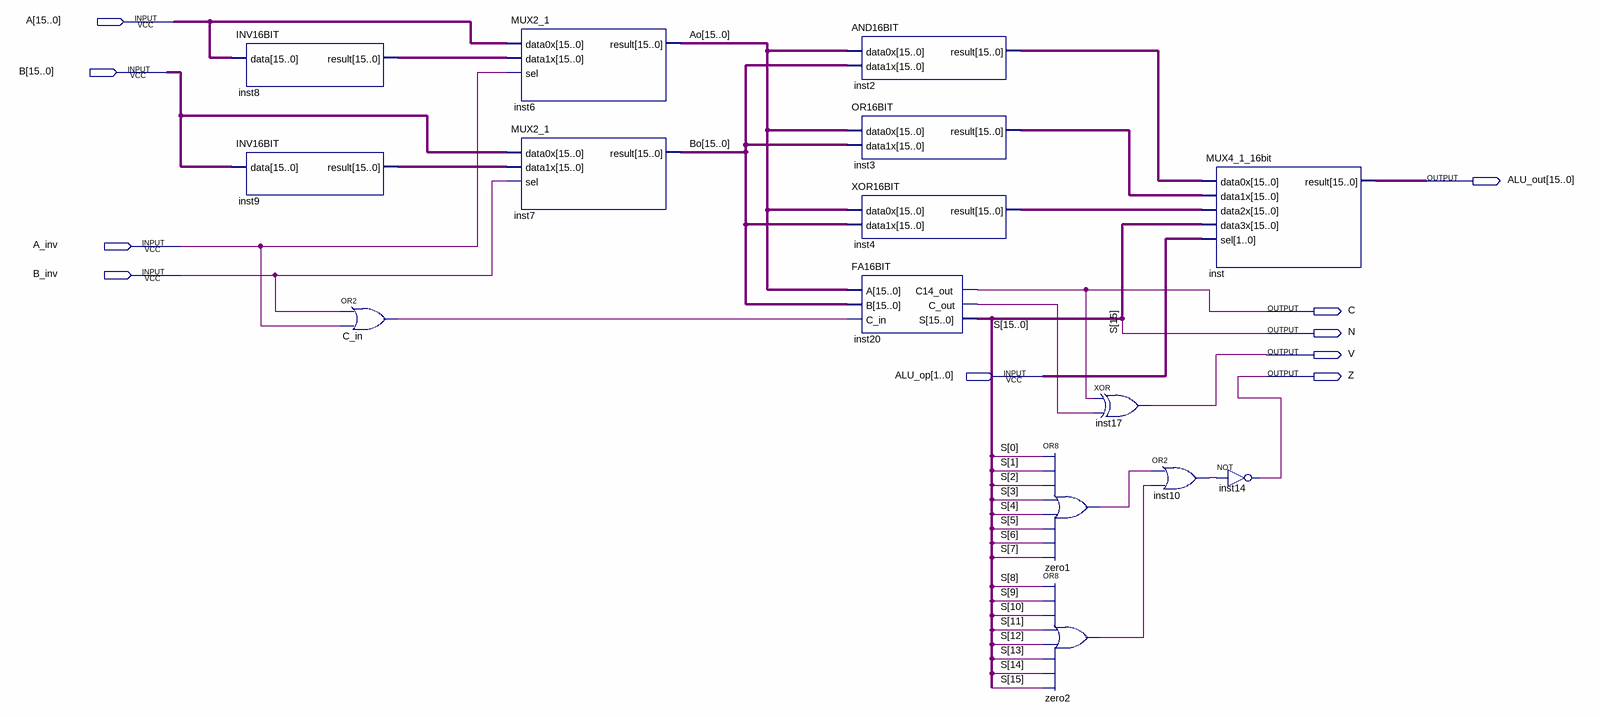
[diagram p0: schematic sheet]
// Quartus schematic ALU.bdf as structural Verilog: 15 symbols, 10 pins
module ALU (
  input  [15:0] A,
  input  [15:0] B,
  input  A_inv,
  input  B_inv,
  input  [1:0] ALU_op,
  output [15:0] ALU_out,
  output C,
  output N,
  output V,
  output Z
);

  wire C_in_out, inst10_out, inst20_c_out, zero1_out, zero2_out;
  wire [14:0] S;
  wire [15:0] Ao, Bo, inst2_result, inst3_result, inst4_result, inst8_result, inst9_result;

  INV16BIT inst8 (.data(A), .result(inst8_result));
  INV16BIT inst9 (.data(B), .result(inst9_result));
  or C_in (C_in_out, B_inv, A_inv);
  MUX2_1 inst6 (.data0x(A), .data1x(inst8_result), .sel(A_inv), .result(Ao));
  MUX2_1 inst7 (.data0x(B), .data1x(inst9_result), .sel(B_inv), .result(Bo));
  AND16BIT inst2 (.data0x(Ao), .data1x(Bo), .result(inst2_result));
  OR16BIT inst3 (.data0x(Ao), .data1x(Bo), .result(inst3_result));
  XOR16BIT inst4 (.data0x(Ao), .data1x(Bo), .result(inst4_result));
  FA16BIT inst20 (.A(Ao), .B(Bo), .C_in(C_in_out), .C14_out(C), .C_out(inst20_c_out), .S({N, S}));
  or zero1 (zero1_out, S[0], S[1], S[2], S[3], S[4], S[5], S[6], S[7]);
  or zero2 (zero2_out, S[8], S[9], S[10], S[11], S[12], S[13], S[14], N);
  xor inst17 (V, C, inst20_c_out);
  or inst10 (inst10_out, zero1_out, zero2_out);
  MUX4_1_16bit inst (
    .data0x(inst2_result), .data1x(inst3_result), .data2x(inst4_result), .data3x({N, S}), .sel(ALU_op),
    .result(ALU_out));
  not inst14 (Z, inst10_out);

  // Other names for the same wires on the sheet: S[15] = N
endmodule
